# EAGLE design pulse_generator_pth (EAGLE 8.3.2)
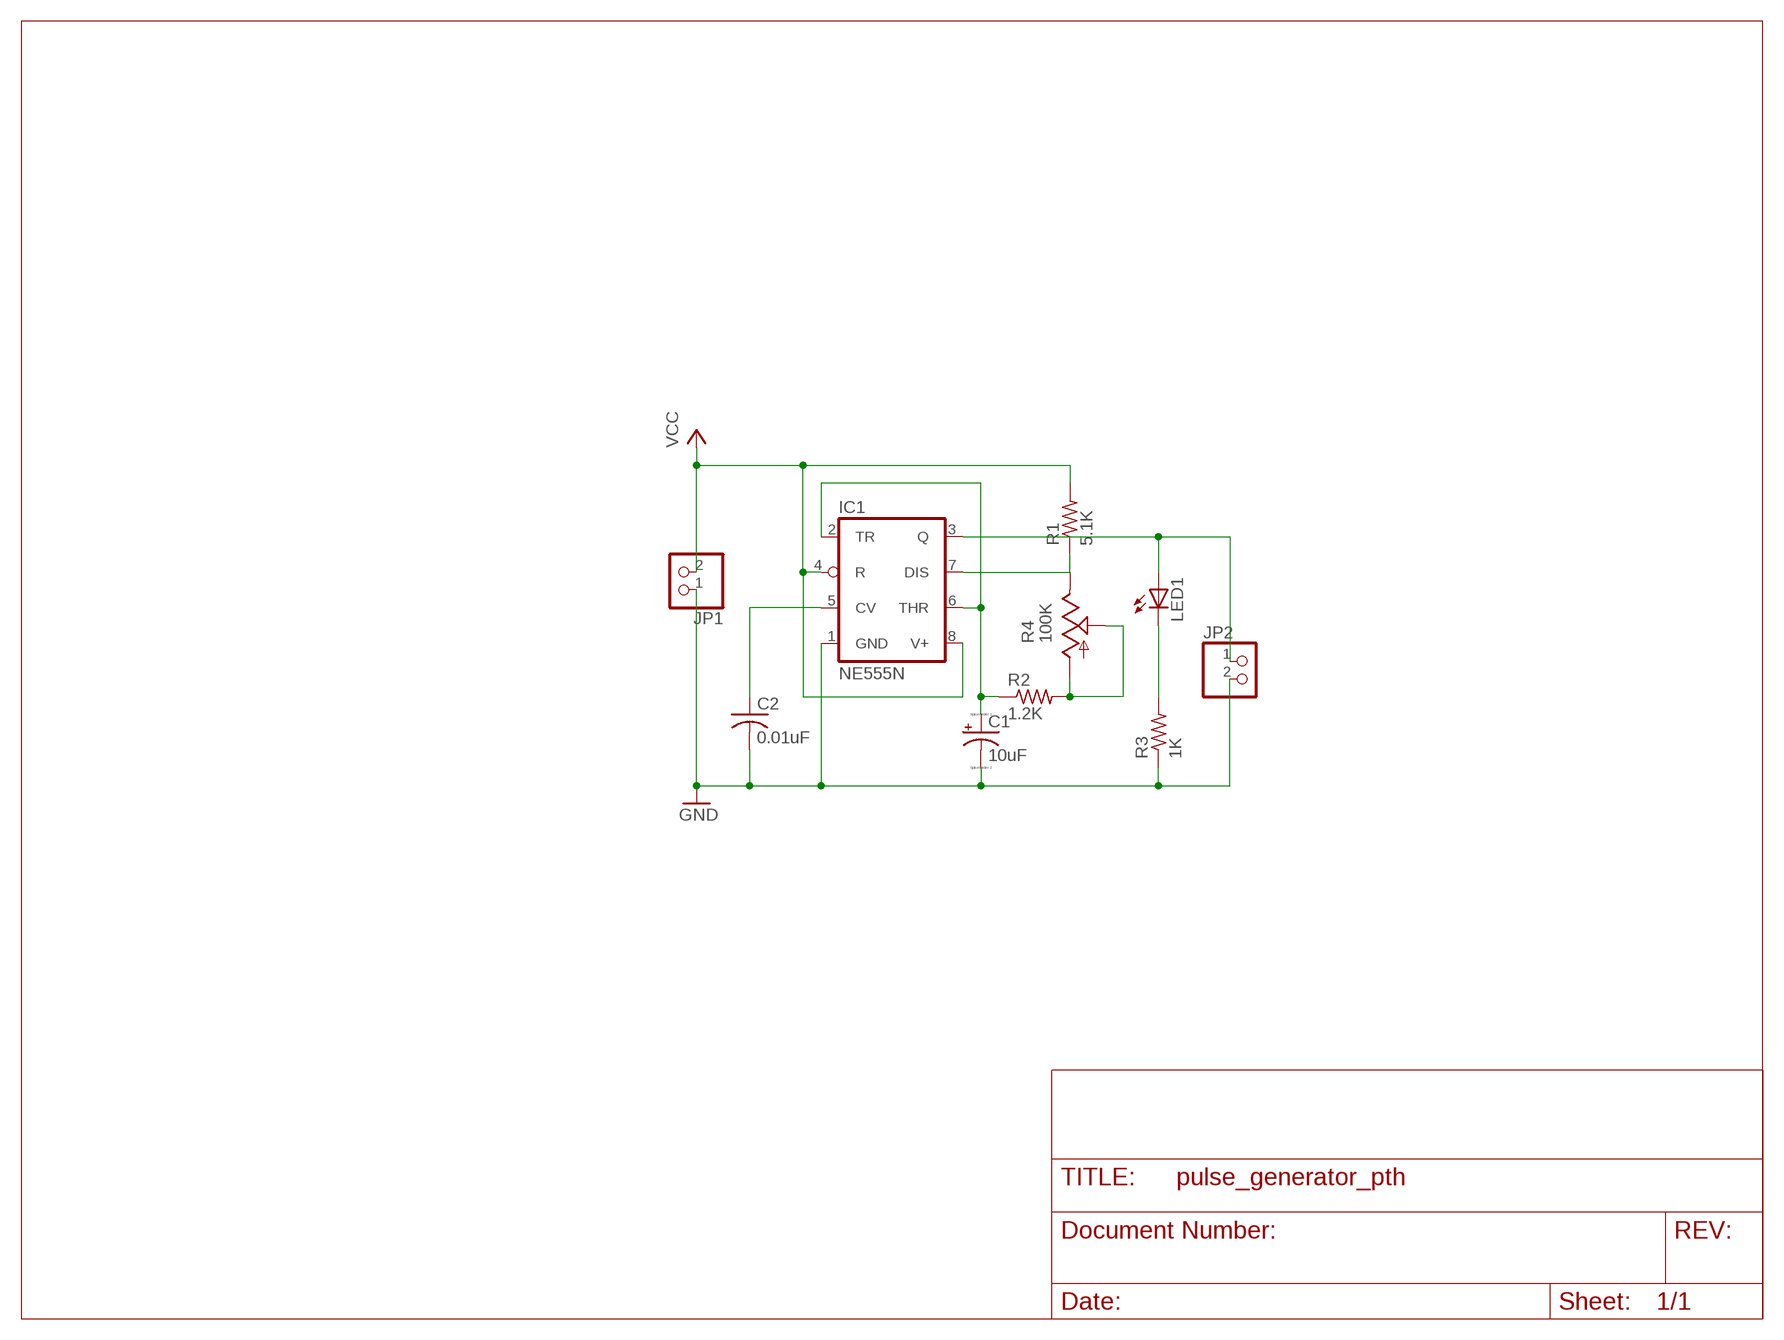
[diagram p0: schematic, sheet 1]

## Parts
C1  10uF  CPOL-USE2-5  [E2-5]
C2  0.01uF  C-US025-040X050  [C025-040X050]
IC1  NE555N  [DIL08]
JP1  PINHD-1X2  [1X02]
JP2  PINHD-1X2  [1X02]
LED1  LED5MM  [LED5MM]
R1  5.1K  R-US_0204/7  [0204/7]
R2  1.2K  R-US_0204/7  [0204/7]
R3  1K  R-US_0204/7  [0204/7]
R4  100K  TRIM_US-B25U  [B25U]

## Nets
GND: C1.- C2.2 IC1.1(GND) JP1.1 JP2.2 R3.1
N$1: C1.+ IC1.2(TR) IC1.6(THR) R2.1
N$2: R2.2 R4.A R4.S
N$3: IC1.7(DIS) R1.1 R4.E
N$4: C2.1 IC1.5(CV)
N$5: IC1.3(Q) JP2.1 LED1.A
N$6: LED1.K(C) R3.2
VCC: IC1.4(R) IC1.8(V+) JP1.2 R1.2

## Library data of the parts
C1 = resistor:CPOL-US: POLARIZED CAPACITOR, American symbol
C2 = resistor:C-US: CAPACITOR, American symbol
IC1 = linear:*555: TIMER
JP1 JP2 = pinhead:PINHD-1X2: PIN HEADER
LED1 = led:LED: LED OSRAM: - CHIPLED LG R971, LG N971, LY N971, LG Q971, LY Q971, LO R971, LY R971 LH N974, LH R974 LS Q976, LO Q976, LY Q976 LO Q996 - Hyper CHIPLED LW Q18S LB Q993, LB Q99A, LB R99A - SideLED LS A670, LO A670, LY A670, LG A670, LP A670 LB A673, LV A673, LT A673, LW A673 LH A674 LY A675 LS A676, LA A676, LO A676, LY A676, LW A676 LS A679, LY A679, LG A679 - Hyper Micro SIDELED® LS Y876, LA Y876, LO Y876, LY Y876 LT Y87S - SmartLED LW L88C, LW L88S LB L89C, LB L89S, LG L890 LS L89K, LO L89K, LY L89K LS L896, LA L896, LO L896, LY L896 - TOPLED LS T670, LO T670, LY T670, LG T670, LP T670 LSG T670, LSP T670, LSY T670, LOP T670, LYG T670 LG T671, LOG T671, LSG T671 LB T673, LV T673, LT T673, LW T673 LH T674 LS T676, LA T676, LO T676, LY T676, LB T676, LH T676, LSB T676, LW T676 LB T67C, LV T67C, LT T67C, LS T67K, LO T67K, LY T67K, LW E67C LS E67B, LA E67B, LO E67B, LY E67B, LB E67C, LV E67C, LT E67C LW T67C LS T679, LY T679, LG T679 LS T770, LO T770, LY T770, LG T770, LP T770 LB T773, LV T773, LT T773, LW T773 LH T774 LS E675, LA E675, LY E675, LS T675 LS T776, LA T776, LO T776, LY T776, LB T776 LHGB T686 LT T68C, LB T68C - Hyper Mini TOPLED® LB M676 - Mini TOPLED Santana® LG M470 LS M47K, LO M47K, LY M47K Source: http://www.osram.convergy.de LUXEON: - LUMILED® LXK2-PW12-R00, LXK2-PW12-S00, LXK2-PW14-U00, LXK2-PW14-V00 LXK2-PM12-R00, LXK2-PM12-S00, LXK2-PM14-U00 LXK2-PE12-Q00, LXK2-PE12-R00, LXK2-PE12-S00, LXK2-PE14-T00, LXK2-PE14-U00 LXK2-PB12-K00, LXK2-PB12-L00, LXK2-PB12-M00, LXK2-PB14-N00, LXK2-PB14-P00, LXK2-PB14-Q00 LXK2-PR12-L00, LXK2-PR12-M00, LXK2-PR14-Q00, LXK2-PR14-R00 LXK2-PD12-Q00, LXK2-PD12-R00, LXK2-PD12-S00 LXK2-PH12-R00, LXK2-PH12-S00 LXK2-PL12-P00, LXK2-PL12-Q00, LXK2-PL12-R00 Source: www.luxeon.com KINGBRIGHT: KA-3528ASYC Source: www.kingbright.com
R1-R3 = resistor:R-US_: RESISTOR, American symbol
R4 = pot:TRIM_US-: POTENTIOMETER

## Board
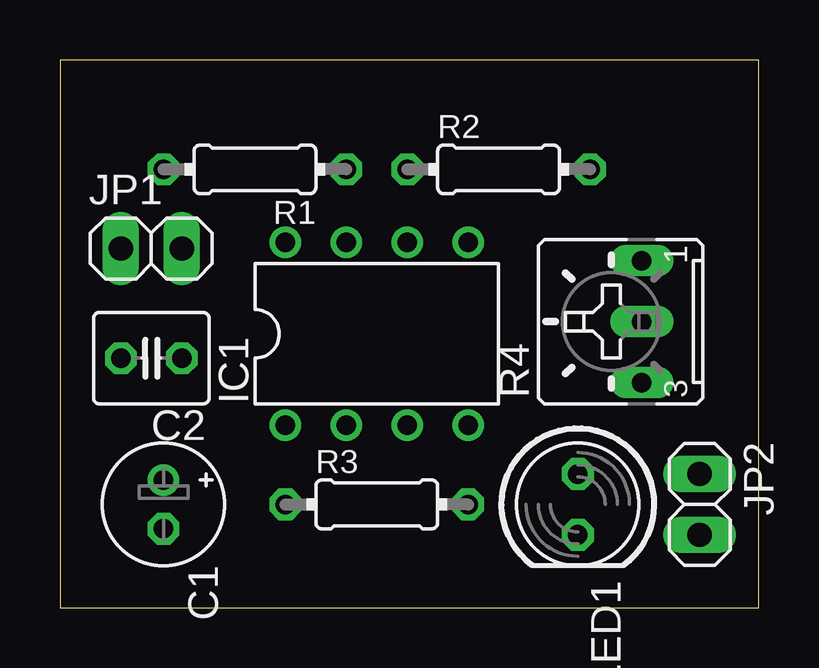
[diagram p1: board, top side]
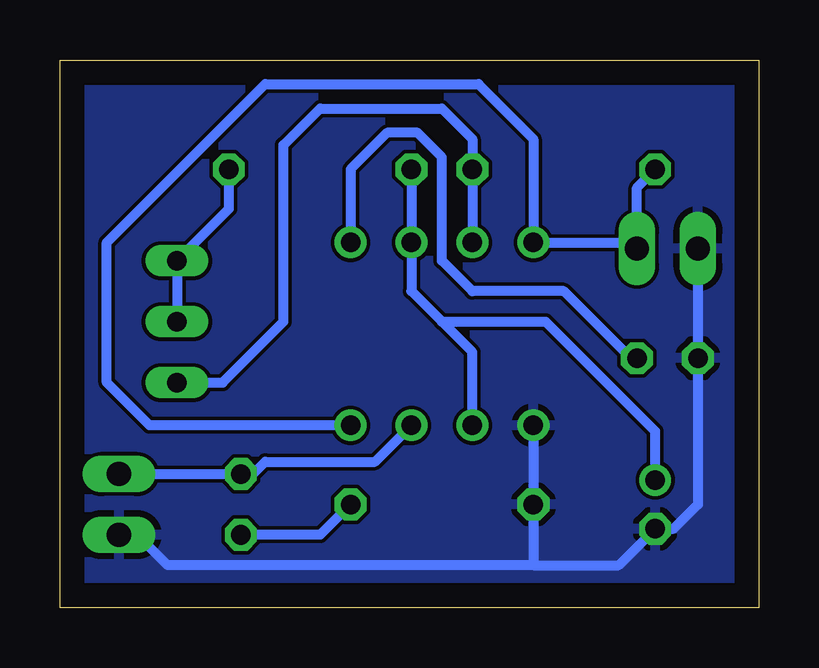
[diagram p2: board, bottom side, seen from below]

Size 29.13 x 22.85 mm. Coordinates in mm from the lower left corner, seen from the top.
Outline: 0,0 29.13,0 29.13,22.85 0,22.85 0,0
Copper layers (1*16): Top 0.035mm / dielectric 1.5mm / Bottom 0.035mm
Design rules "default": minimum track width 6mil, minimum drill 0.35mm, track to track 6mil, track to pad 6mil, pad to pad 6mil, via to via 6mil, smd to smd 6mil, copper to edge 40mil, drill to drill 6mil, minimum pad ring 10mil, minimum via ring 8mil, stop-mask expansion 4mil, vias tented up to drill 0mil, thermal gap 10mil

### Footprints (pad centres in the part's own frame; a part is rotated, then mirrored left to right if it is on the bottom)
E2-5 = drill 0.813 pad 1.27: + -1.016,0 | drill 0.813 pad 1.27 octagon: - 1.016,0
C025-040X050 = drill 0.813 octagon: 1 -1.27,0; 2 1.27,0
DIL08 = drill 0.813 pad 1.27: 1 -3.81,-3.81; 2 -1.27,-3.81; 3 1.27,-3.81; 4 3.81,-3.81; 5 3.81,3.81; 6 1.27,3.81; 7 -1.27,3.81; 8 -3.81,3.81
1X02 = drill 1.016 long: 1 -1.27,0; 2 1.27,0
LED5MM = drill 0.813 octagon: A -1.27,0; K 1.27,0
0204/7 = drill 0.813 octagon: 1 -3.81,0; 2 3.81,0
B25U = drill 0.813 long: A 2.54,-0.889; E -2.54,-0.889; S 0,-0.889

### Placement (x,y rotation side)
C1  4.32,4.32 270 top
C2  3.81,10.41 180 top
IC1  13.21,11.43 0 top
JP1  3.81,14.99 0 top
JP2  26.67,4.32 270 top
LED1  21.59,4.32 270 top
R1  8.13,18.29 180 top
R2  18.29,18.29 0 top
R3  13.21,4.32 0 top
R4  23.37,11.94 90 top

### Tracks (layer width: path | path; a pad name or v marks a point on that pad's centre or on a via)
GND
  Bottom 0.406: IC1.1 R3.1 9.4,1.78 | JP2.2 25.91,3.05 24.64,1.78 9.4,1.78 | 9.4,1.78 5.84,1.78 C1.- 3.56,3.3 2.54,4.32 C2.2 JP1.1
  pour Bottom: 0.51,0.51 28.7,0.51 28.7,22.61 0.51,22.61
N$1
  Bottom 0.406: R2.1 IC1.6 14.48,13.21 13.21,11.94 | C1.+ 4.32,7.37 8.89,11.94 13.21,11.94 | IC1.2 11.94,10.67 13.21,11.94
N$2
  Bottom 0.406: R2.2 22.1,16.64 R4.A R4.S
N$3
  Bottom 0.406: IC1.7 R1.1 11.94,19.56 13.21,20.83 18.29,20.83 19.81,19.3 19.81,11.94 22.35,9.4 R4.E
N$4
  Bottom 0.406: C2.1 5.33,10.41 8.13,13.21 11.94,13.21 13.21,14.48 13.21,18.8 14.22,19.81 15.49,19.81 17.02,18.29 IC1.5
N$5
  Bottom 0.406: JP2.1 LED1.A 21.08,5.59 20.57,6.1 16,6.1 IC1.3
N$6
  Bottom 0.406: R3.2 18.29,3.05 LED1.K
VCC
  Bottom 0.406: R1.2 5.08,17.53 JP1.2 5.33,15.24 IC1.8 9.4,19.56 11.68,21.84 20.57,21.84 27.18,15.24 27.18,9.4 25.4,7.62 IC1.4